# EAGLE design IOB-Adapter-Turtle (EAGLE 7.7.0)

## Sheet 1 of 2
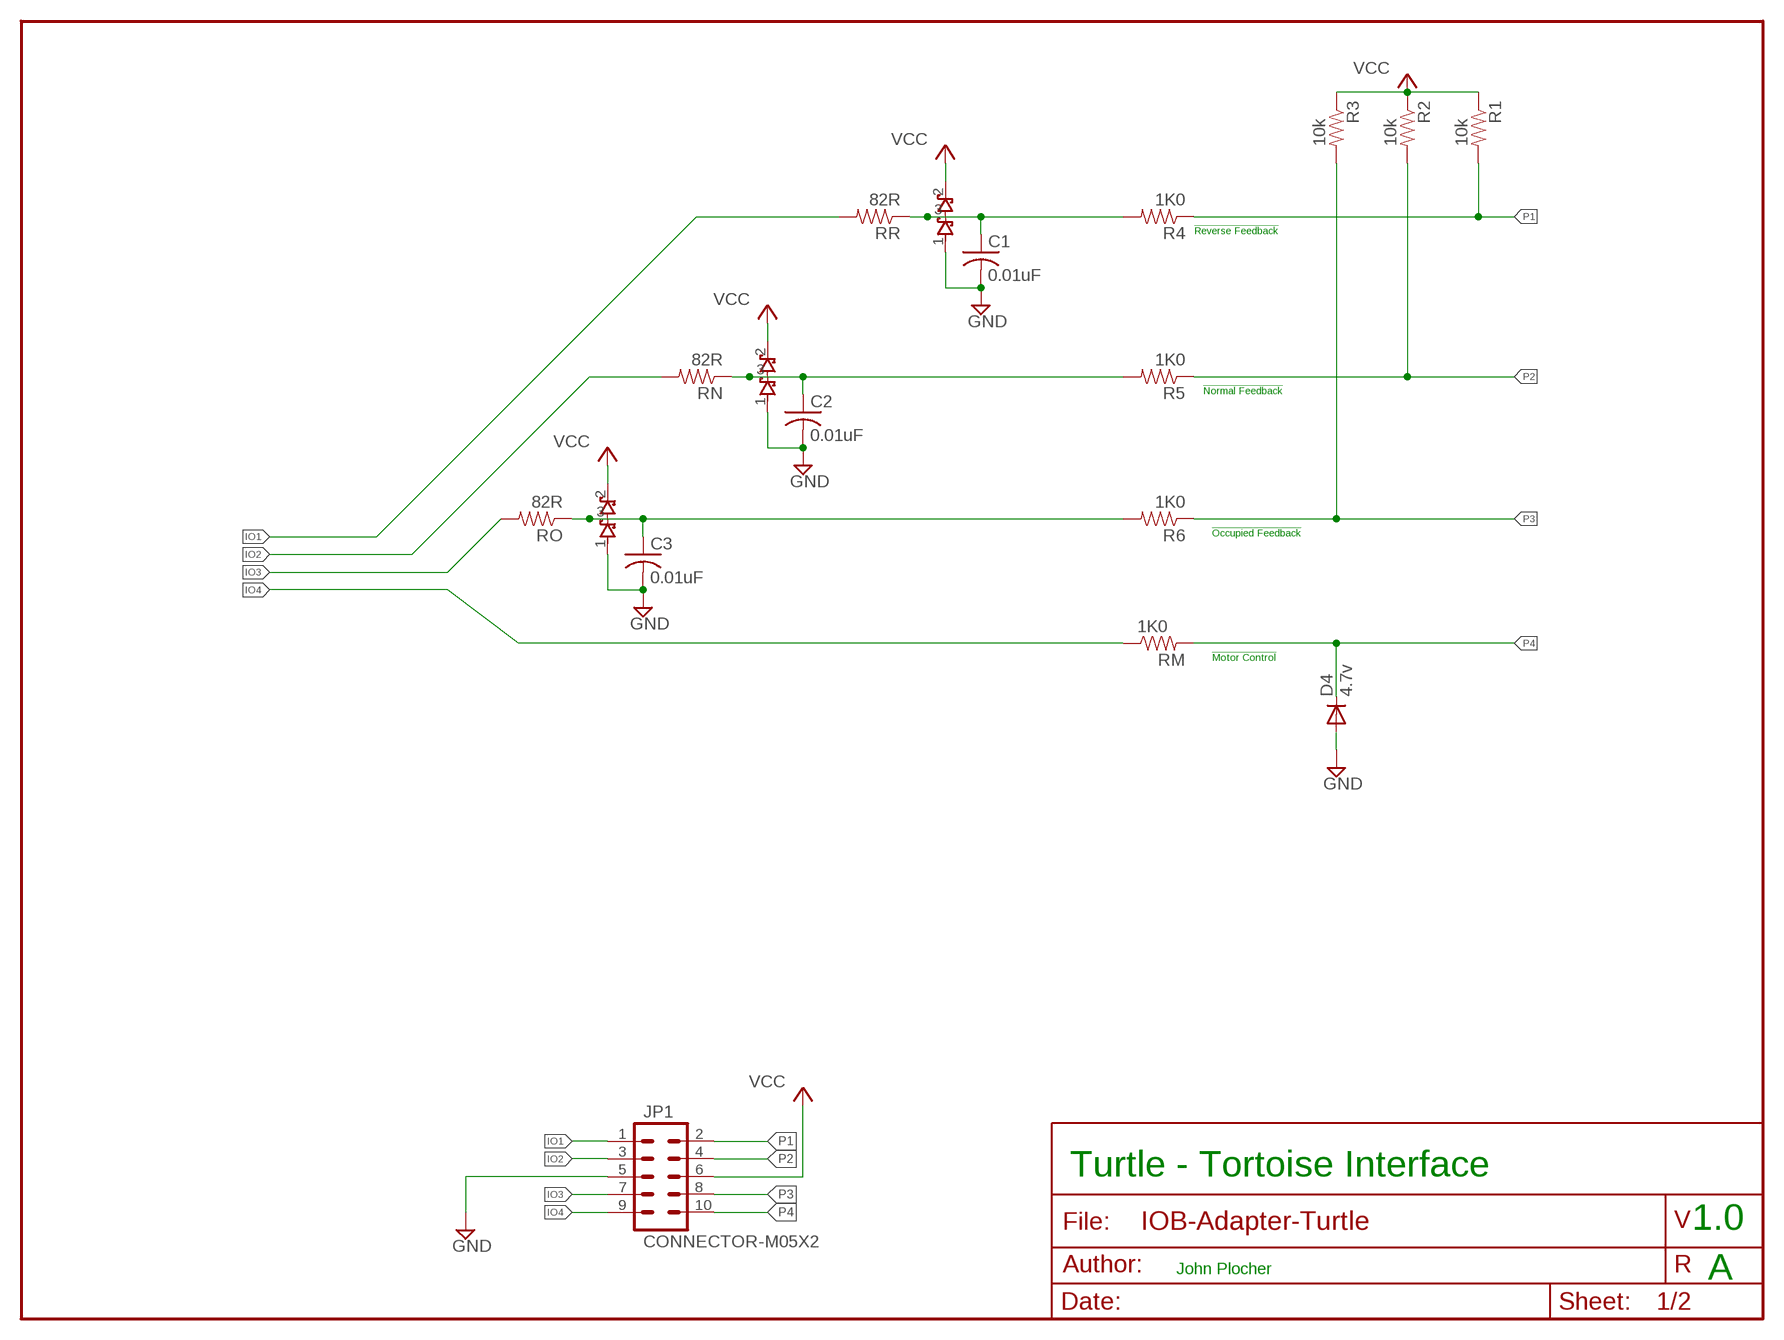
[diagram p0: schematic, sheet 1]

### Parts
C1  0.01uF  CAP0603  [0603-CAP]
C2  0.01uF  CAP0603  [0603-CAP]
C3  0.01uF  CAP0603  [0603-CAP]
D1  BAT54S  DIODE-BAT54S23  [SOT23]
D2  BAT54S  DIODE-BAT54S23  [SOT23]
D3  BAT54S  DIODE-BAT54S23  [SOT23]
D4  4.7v  DIODESOT23  [SOT23]
JP1  CONNECTOR-M05X2  [IOB-V3-MODULE]
R1  10k  R0805-RES  [0805-RES]
R2  10k  R0805-RES  [0805-RES]
R3  10k  R0805-RES  [0805-RES]
R4  1K0  R0603-RES  [0603-RES]
R5  1K0  R0603-RES  [0603-RES]
R6  1K0  R0603-RES  [0603-RES]
RM  1K0  R0603-RES  [0603-RES]
RN  82R  R0805-RES  [0805-RES]
RO  82R  R0805-RES  [0805-RES]
RR  82R  R0805-RES  [0805-RES]

### Nets
GND [Power]: C1.2 C2.2 C3.2 D1.1(A1) D2.1(A1) D3.1(A1) D4.1(A) JP1.5
IO1 [signals]: JP1.1 RR.2
IO2 [signals]: JP1.3 RN.2
IO3 [signals]: JP1.7 RO.2
IO4 [signals]: JP1.9 RM.1
N$2: C2.1 D2.3(COM) R5.2 RN.1
N$3: C1.1 D1.3(COM) R4.2 RR.1
N$14: C3.1 D3.3(COM) R6.2 RO.1
P1 [signals]: JP1.2 R1.2 R4.1
P2 [signals]: JP1.4 R2.2 R5.1
P3 [signals]: JP1.8 R3.2 R6.1
P4 [signals]: D4.3(C) JP1.10 RM.2
VCC [Power]: D1.2(C2) D2.2(C2) D3.2(C2) JP1.6 R1.1 R2.1 R3.1

### Notes on the sheet
- !Reverse Feedback
- !Normal Feedback
- !Occupied Feedback
- !Motor Control
- Turtle - Tortoise Interface
- 1.0
- John Plocher
- A

## Sheet 2 of 2
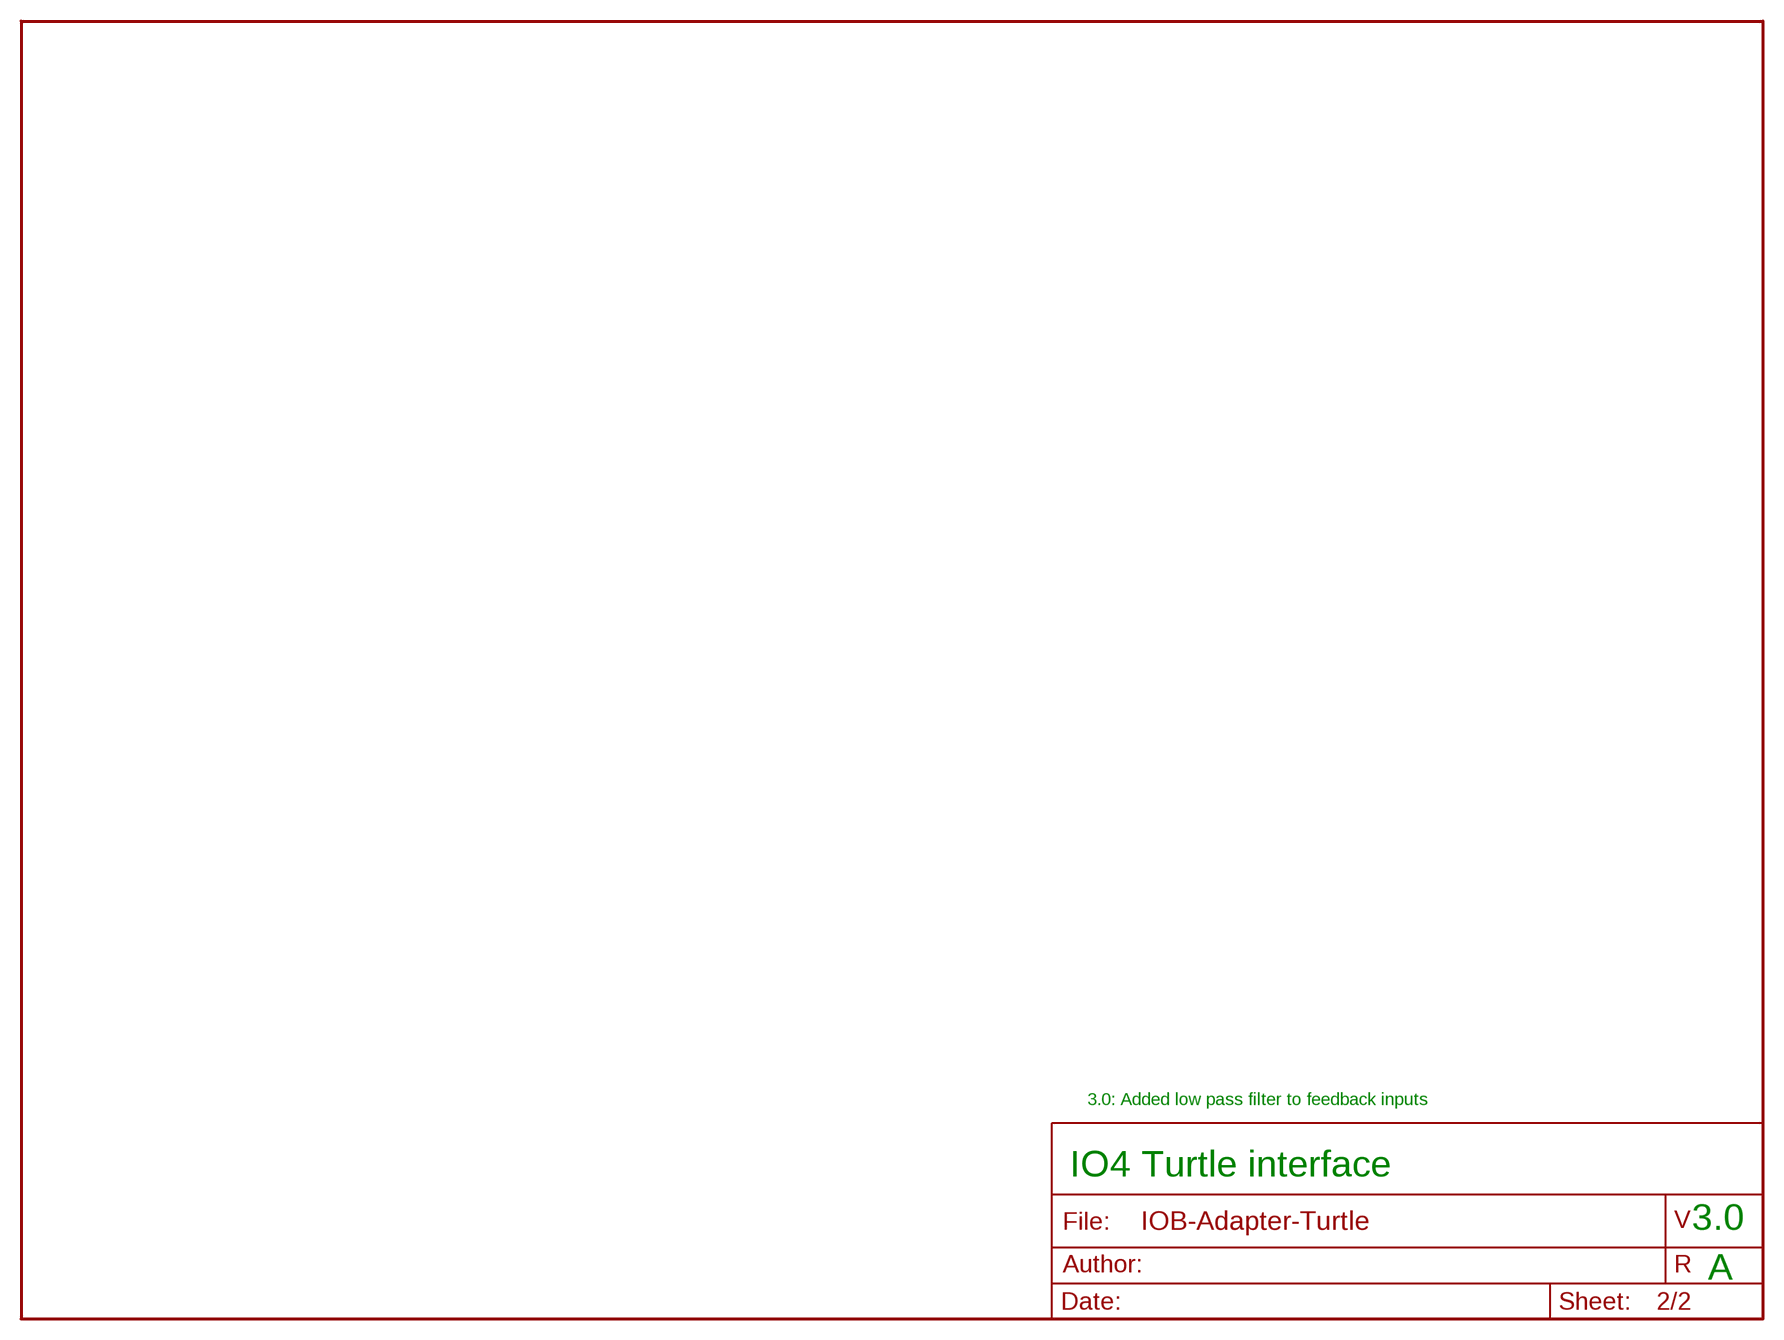
[diagram p1: schematic, sheet 2]

### Notes on the sheet
- 3.0: Added low pass filter to feedback inputs
- IO4 Turtle interface
- 3.0
- A

## Library data of the parts
C1-C3 = SPCoast:CAP*
D1-D3 = SPCoast:DIODE-BAT54S
D4 = SPCoast:DIODE: Diode These are standard reverse protection diodes and small signal diodes. SMA package can handle up to about 1A. SOD-323 can handle about 200mA. What the SOD-323 package when ordering, there are some mfgs out there that are 5-pin packages.
JP1 = SPCoast:CONNECTOR-M05X2: Header 5x2 Standard 10-pin dual row 0.1" header. Commonly used with AVR-ISP. Use with Spark Fun Electronics SKU: PRT-00778
R1-R6 RM RN RO RR = SPCoast:R*: Resistor Basic schematic elements and footprints for 0603, 1206, and PTH 1/10th watt (small) resistors.

## Net classes
0 default: width 0.254 mm, drill 0.4 mm, clearance 0.102 mm
1 Power: width 0.254 mm, drill 0.4 mm, clearance 0.102 mm
2 signals: width 0.254 mm, drill 0.4 mm, clearance 0.102 mm

## Board
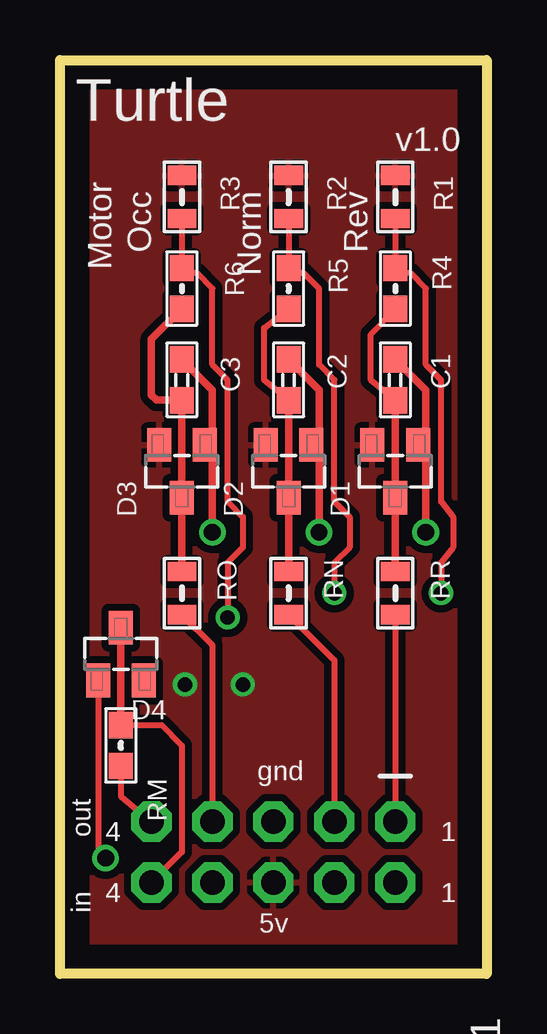
[diagram p2: board, top side]
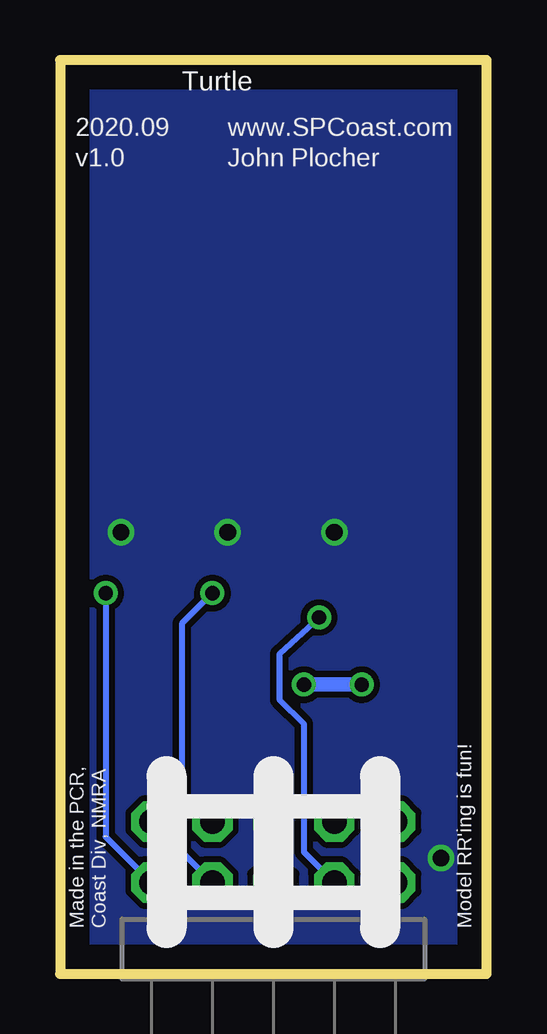
[diagram p3: board, bottom side, seen from below]

Size 17.78 x 38.1 mm. Coordinates in mm from the lower left corner, seen from the top.
Outline: 0,38.1 17.78,38.1 17.78,0 0,0 0,38.1
Copper layers (1*16): Top 0.035mm / dielectric 1.5mm / Bottom 0.035mm
Design rules "default": minimum track width 10mil, minimum drill 0.6mm, track to track 8mil, track to pad 8mil, pad to pad 8mil, via to via 8mil, smd to smd 8mil, copper to edge 40mil, drill to drill 8mil, minimum pad ring 10mil, minimum via ring 8mil, stop-mask expansion 4mil, vias tented up to drill 0mil, thermal gap 10mil

### Footprints (pad centres in the part's own frame; a part is rotated, then mirrored left to right if it is on the bottom)
0603-CAP = smd 1.1 x 1: 1 -0.85,0; 2 0.85,0
SOT23 = smd 1.4 x 1: 1 1.1,-0.95; 2 1.1,0.95; 3 -1.1,0
IOB-V3-MODULE = drill 1.016 pad 1.676 octagon: 1 -1.27,-5.08; 2 1.27,-5.08; 3 -1.27,-2.54; 4 1.27,-2.54; 5 -1.27,0; 6 1.27,0; 7 -1.27,2.54; 8 1.27,2.54; 9 -1.27,5.08; 10 1.27,5.08
0805-RES = smd 0.8 x 1.2: 1 -0.9,0; 2 0.9,0
0603-RES = smd 1.1 x 1: 1 -0.85,0; 2 0.85,0

### Placement (x,y rotation side)
C1  13.97,24.77 90 top
C2  9.53,24.77 90 top
C3  5.08,24.77 90 top
D1  13.97,20.95 90 top
D2  9.53,20.95 90 top
D3  5.08,20.95 90 top
D4  2.54,13.34 270 top
JP1  8.89,5.08 270 bottom
R1  13.97,32.38 270 top
R2  9.53,32.38 270 top
R3  5.08,32.38 270 top
R4  13.97,28.57 270 top
R5  9.53,28.57 270 top
R6  5.08,28.57 270 top
RM  2.54,9.53 90 top
RN  9.53,15.88 270 top
RO  5.08,15.88 270 top
RR  13.97,15.88 270 top

### Tracks (layer width: path | path; a pad name or v marks a point on that pad's centre or on a via)
GND  (via drill 0.7)
  Top 0.254: D4.1 1.59,5.14 v1.91,4.83
  Top 0.305: 6.35,22.38 D3.1 6.35,22.07 | 6.35,22.07 6.35,24.34 C3.2 | v10.79,18.41 10.79,22.05 D2.1 10.79,22.23 10.79,24.34 C2.2 | v15.24,18.41 15.24,22.05 D1.1 15.24,22.23 15.24,24.34 C1.2 | 6.35,22.07 v6.35,18.41
  pour Bottom (isolate 0.254, no thermals): 0.38,0.38 0.38,37.72 17.4,37.72 17.4,0.38
IO1
  Top 0.254: RR.2 JP1.1
IO2
  Top 0.254: RN.2 11.43,13.07 JP1.3
IO3
  Top 0.254: RO.2 6.35,13.71 JP1.7
IO4
  Top 0.254: RM.1 2.54,7.41 JP1.9
N$2
  Top 0.254: C2.1 8.51,24.77 8.51,26.92 R5.2
  Top 0.305: RN.1 D2.3 C2.1
N$3
  Top 0.254: C1.1 12.95,24.77 12.95,26.67 R4.2
  Top 0.305: RR.1 D1.3 C1.1
N$14
  Top 0.305: RO.1 D3.3 C3.1 4.03,23.91 3.81,24.13 3.81,26.45 R6.2
P1  (via drill 0.6)
  Top 0.254: R1.2 R4.1 14.19,29.21 14.61,29.21 15.24,28.57 15.24,25.4 15.88,24.77 15.88,19.68 16.38,19.05 16.38,17.78 15.88,17.14 v15.88,15.88
  Bottom 0.254: v15.88,15.88 15.88,5.71 JP1.2
P2  (via drill 0.6)
  Top 0.254: R2.2 R5.1 9.74,29.21 10.16,29.21 10.79,28.57 10.79,25.4 11.43,24.77 11.43,19.68 12.06,19.05 12.06,17.78 11.43,17.14 v11.43,15.88
  Bottom 0.254: v11.43,15.88 12.7,14.61 12.7,5.08 JP1.4
P3  (via drill 0.6)
  Top 0.254: R3.2 R6.1 5.29,29.21 5.71,29.21 6.35,28.57 6.35,25.4 6.99,24.77 6.99,19.68 7.62,19.05 7.62,17.78 6.99,17.14 v6.99,14.86
  Bottom 0.254: v6.99,14.86 8.64,13.34 8.64,11.43 7.62,10.41 7.62,5.08 JP1.8
P4
  Top 0.254: RM.2 4.23,10.38 5.08,9.53 5.08,5.08 JP1.10
  Top 0.305: RM.2 D4.3
VCC  (via drill 0.6)
  Bottom 0.61: v5.21,12.06 v7.62,12.06
  pour Top (isolate 0.305): 0.38,0.38 0.38,37.72 17.4,37.72 17.4,0.38

### Text on the board
tPlace: Turtle | v1.0 | Motor | Occ | Norm | Rev
bPlace: Turtle | www.SPCoast.com | 2020.09 | John Plocher | v1.0 | Model RR'ing is fun! | Made in the PCR, / Coast Div, NMRA
Document: Green
_tNames: R3 | R2 | R1 | R6 | R5 | R4 | C3 | C2 | C1 | D3 | D2 | D1 | RO | RN | RR | D4 | RM | JP1